# EAGLE schematic led_current_limit (EAGLE 6.4)
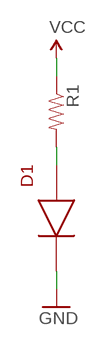
[diagram p0: schematic, sheet 1]

## Parts
D1  APA3010SF4C  [APA3010SF4C]
R1  RESISTOR0402-RES  [0402-RES]

## Nets
GND: D1.2
N$1: D1.1 R1.2
VCC: R1.1

## Library data of the parts
D1 = SparkFun-LED:APA3010SF4C: Right-angle 880nm SMT infrared LED
R1 = SparkFun-Passives:RESISTOR: Resistor Basic schematic elements and footprints for 0603, 1206, and PTH resistors.